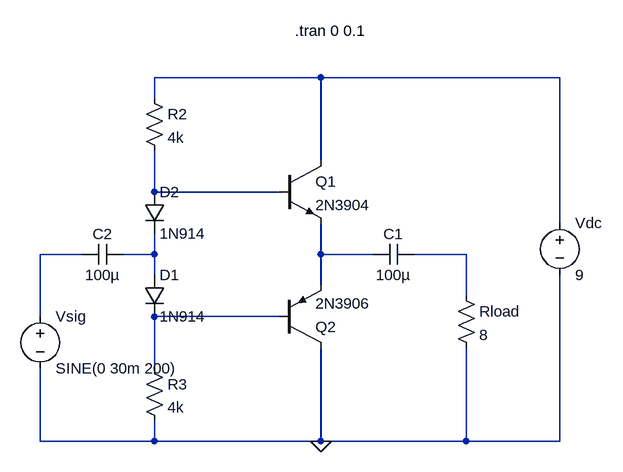
[diagram p0: schematic Draft2.asc]
Draft2.asc, the LTspice schematic file:
Version 4
SHEET 1 932 680
WIRE 496 -64 240 -64
WIRE 864 -64 496 -64
WIRE 240 -32 240 -64
WIRE 496 64 496 -64
WIRE 240 112 240 48
WIRE 432 112 240 112
WIRE 864 160 864 -64
WIRE 128 208 64 208
WIRE 240 208 240 176
WIRE 240 208 192 208
WIRE 496 208 496 160
WIRE 576 208 496 208
WIRE 720 208 640 208
WIRE 240 240 240 208
WIRE 496 256 496 208
WIRE 720 272 720 208
WIRE 64 304 64 208
WIRE 432 304 240 304
WIRE 240 384 240 304
WIRE 64 496 64 384
WIRE 240 496 240 464
WIRE 240 496 64 496
WIRE 496 496 496 352
WIRE 496 496 240 496
WIRE 720 496 720 352
WIRE 720 496 496 496
WIRE 864 496 864 240
WIRE 864 496 720 496
FLAG 496 496 0
SYMBOL npn 432 64 R0
SYMATTR InstName Q1
SYMATTR Value 2N3904
SYMBOL pnp 432 352 M180
SYMATTR InstName Q2
SYMATTR Value 2N3906
SYMBOL res 704 256 R0
SYMATTR InstName Rload
SYMATTR Value 8
SYMBOL cap 640 192 R90
WINDOW 0 0 32 VBottom 2
WINDOW 3 32 32 VTop 2
SYMATTR InstName C1
SYMATTR Value 100µ
SYMBOL res 224 -48 R0
SYMATTR InstName R2
SYMATTR Value 4k
SYMBOL diode 224 240 R0
SYMATTR InstName D1
SYMATTR Value 1N914
SYMBOL diode 224 112 R0
SYMATTR InstName D2
SYMATTR Value 1N914
SYMBOL res 224 368 R0
SYMATTR InstName R3
SYMATTR Value 4k
SYMBOL voltage 864 144 R0
SYMATTR InstName Vdc
SYMATTR Value 9
SYMBOL voltage 64 288 R0
SYMATTR InstName Vsig
SYMATTR Value SINE(0 30m 200)
SYMBOL cap 192 192 R90
WINDOW 0 0 32 VBottom 2
WINDOW 3 32 32 VTop 2
SYMATTR InstName C2
SYMATTR Value 100µ
TEXT 456 -136 Left 2 !.tran 0 0.1

The netlist it stands for:
* Draft2.asc
Q1 N001 N002 N005 0 2N3904
Q2 0 N007 N005 0 2N3906
Rload N006 0 8
C1 N006 N005 100µ
R2 N001 N002 4k
D1 N004 N007 1N914
D2 N002 N004 1N914
R3 N007 0 4k
Vdc N001 0 9
Vsig N003 0 SINE(0 30m 200)
C2 N004 N003 100µ
.model D D
.lib standard.dio
.model NPN NPN
.model PNP PNP
.lib standard.bjt
.tran 0 0.1
.backanno
.end